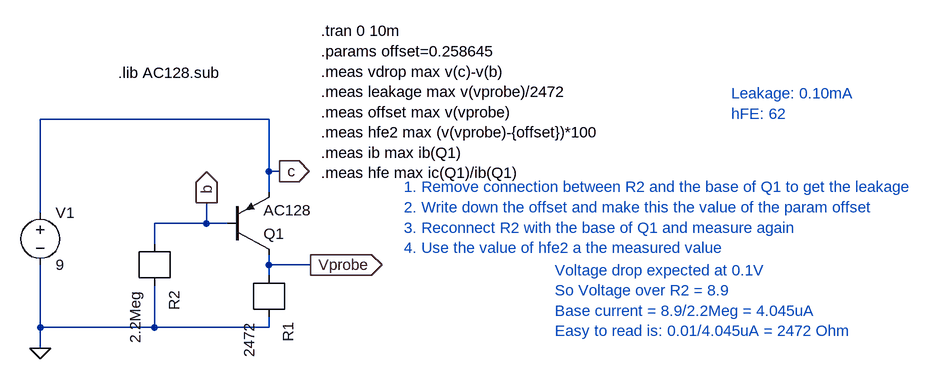
[diagram p0: schematic AC128-hFE.asc]
AC128-hFE.asc, the LTspice schematic file:
Version 4
SHEET 1 2896 680
WIRE 384 96 32 96
WIRE 384 176 384 96
WIRE 400 176 384 176
WIRE 384 208 384 176
WIRE 32 240 32 96
WIRE 288 256 288 224
WIRE 288 256 208 256
WIRE 320 256 288 256
WIRE 208 288 208 256
WIRE 384 320 384 304
WIRE 448 320 384 320
WIRE 384 336 384 320
WIRE 32 416 32 320
WIRE 208 416 208 352
WIRE 208 416 32 416
WIRE 384 416 384 400
WIRE 384 416 208 416
WIRE 32 448 32 416
FLAG 32 448 0
FLAG 448 320 Vprobe
IOPIN 448 320 Out
FLAG 288 224 b
IOPIN 288 224 Out
FLAG 400 176 c
IOPIN 400 176 Out
SYMBOL pnp 320 304 M180
SYMATTR InstName Q1
SYMATTR Value AC128
SYMBOL voltage 32 224 R0
SYMATTR InstName V1
SYMATTR Value 9
SYMBOL r 384 336 R90
SYMATTR InstName R1
SYMATTR Value 2472
SYMBOL r 208 288 R90
SYMATTR InstName R2
SYMATTR Value 2.2Meg
TEXT 464 -40 Left 2 !.tran 0 10m\n.params offset=0.258645\n.meas vdrop max v(c)-v(b)\n.meas leakage max v(vprobe)/2472\n.meas offset max v(vprobe)\n.meas hfe2 max (v(vprobe)-{offset})*100\n.meas ib max ib(Q1)\n.meas hfe max ic(Q1)/ib(Q1)
TEXT 152 24 Left 2 !.lib AC128.sub
TEXT 1096 56 Left 2 ;Leakage: 0.10mA\nhFE: 62
TEXT 824 328 Left 2 ;Voltage drop expected at 0.1V\nSo Voltage over R2 = 8.9\nBase current = 8.9/2.2Meg = 4.045uA\nEasy to read is: 0.01/4.045uA = 2472 Ohm
TEXT 592 200 Left 2 ;1. Remove connection between R2 and the base of Q1 to get the leakage\n2. Write down the offset and make this the value of the param offset\n3. Reconnect R2 with the base of Q1 and measure again\n4. Use the value of hfe2 a the measured value

The netlist it stands for:
* AC128-hFE.asc
Q1 Vprobe b c 0 AC128
V1 c 0 9
R1 0 Vprobe 2472
R2 0 b 2.2Meg
.model NPN NPN
.model PNP PNP
.lib standard.bjt
.tran 0 10m
.params offset=0.258645
.meas vdrop max v(c)-v(b)
.meas leakage max v(vprobe)/2472
.meas offset max v(vprobe)
.meas hfe2 max (v(vprobe)-{offset})*100
.meas ib max ib(Q1)
.meas hfe max ic(Q1)/ib(Q1)
.lib AC128.sub
* Leakage: 0.10mA
* hFE: 62
* Voltage drop expected at 0.1V
* So Voltage over R2 = 8.9
* Base current = 8.9/2.2Meg = 4.045uA
* Easy to read is: 0.01/4.045uA = 2472 Ohm
* 1. Remove connection between R2 and the base of Q1 to get the leakage
* 2. Write down the offset and make this the value of the param offset
* 3. Reconnect R2 with the base of Q1 and measure again
* 4. Use the value of hfe2 a the measured value
.backanno
.end